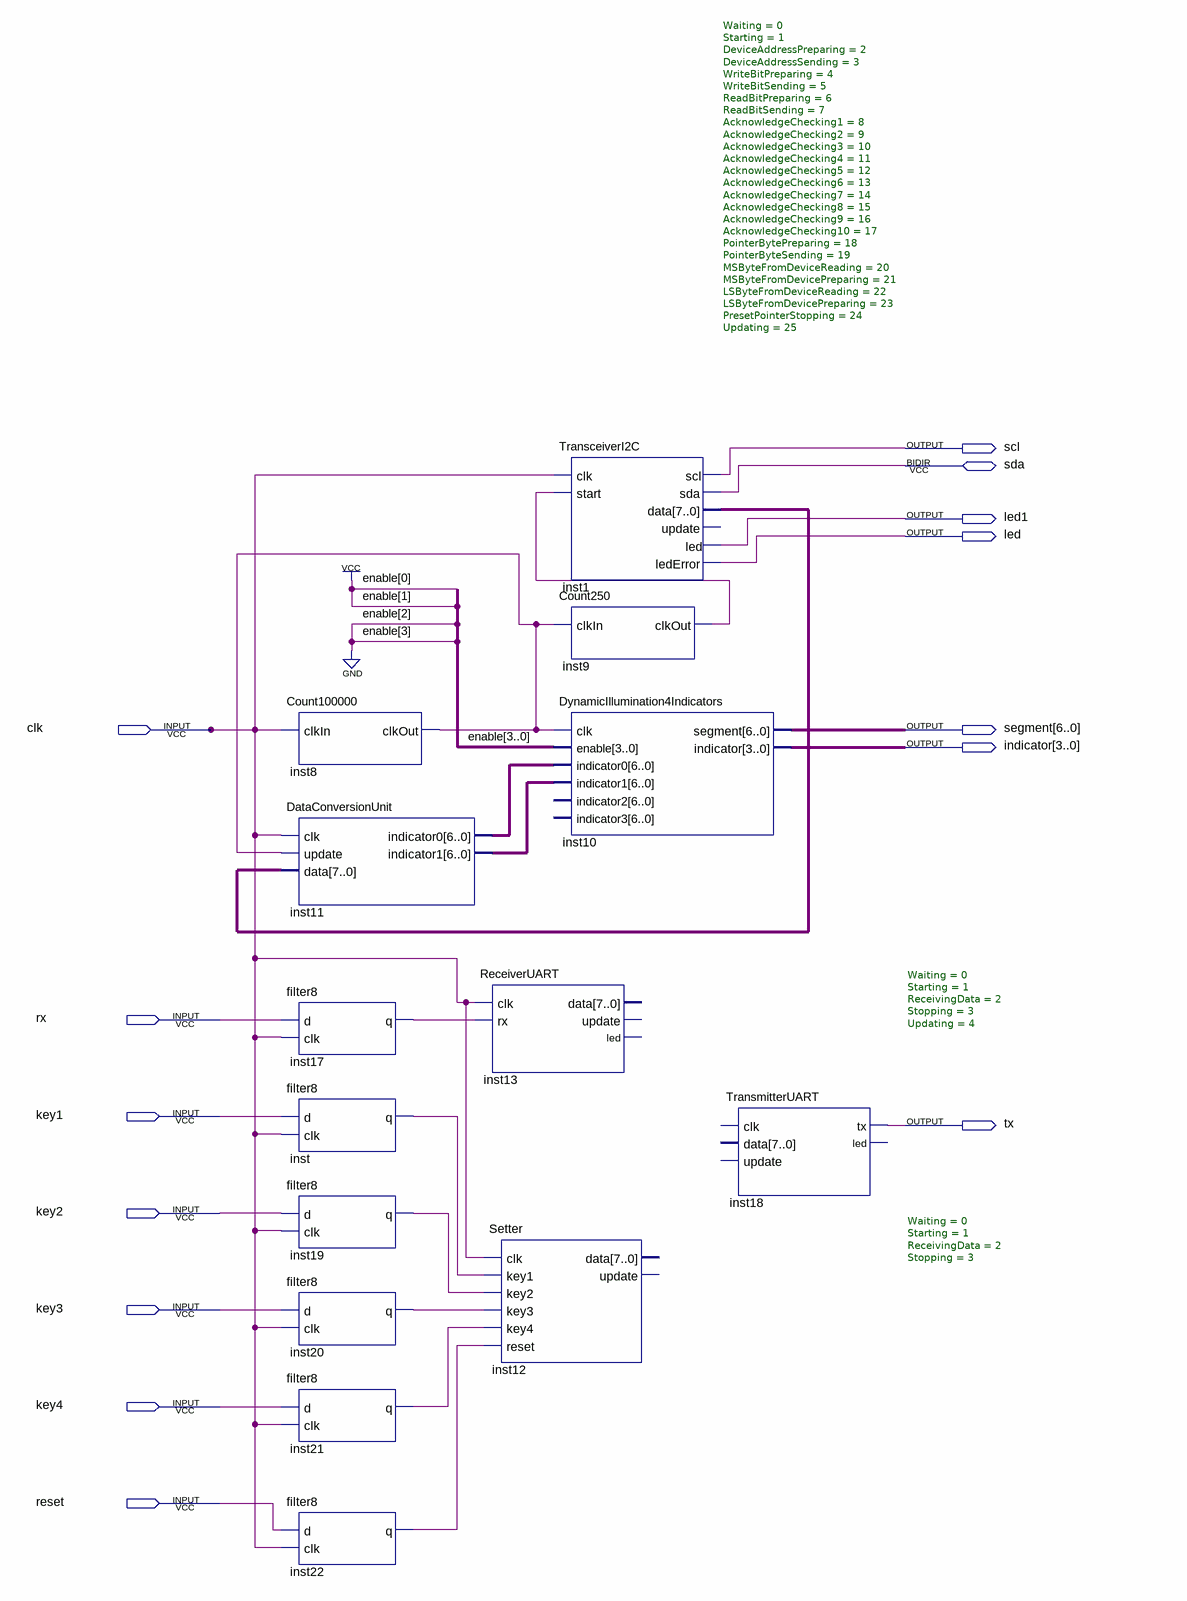
[diagram p0: schematic sheet]
// Quartus schematic VERILOGStart05.bdf as structural Verilog: 14 symbols, 14 pins
module VERILOGStart05 (
  input  clk,
  input  rx,
  input  key1,
  input  key2,
  input  key3,
  input  key4,
  input  reset,
  inout  sda,
  output scl,
  output led1,
  output led,
  output [6:0] segment,
  output [3:0] indicator,
  output tx
);

  wire inst8_clkout, inst9_clkout, inst17_q, inst19_q, inst20_q, inst21_q, inst22_q, inst_q;
  wire [6:0] inst11_indicator0, inst11_indicator1;
  wire [7:0] inst1_data;

  Count100000 inst8 (.clkIn(clk), .clkOut(inst8_clkout));
  DataConversionUnit inst11 (
    .clk(clk), .update(inst8_clkout), .data(inst1_data), .indicator0(inst11_indicator0),
    .indicator1(inst11_indicator1));
  filter8 inst17 (.d(rx), .clk(clk), .q(inst17_q));
  filter8 inst (.d(key1), .clk(clk), .q(inst_q));
  filter8 inst19 (.d(key2), .clk(clk), .q(inst19_q));
  filter8 inst20 (.d(key3), .clk(clk), .q(inst20_q));
  filter8 inst21 (.d(key4), .clk(clk), .q(inst21_q));
  filter8 inst22 (.d(reset), .clk(clk), .q(inst22_q));
  ReceiverUART #(.Waiting(0), .Starting(1), .ReceivingData(2), .Stopping(3), .Updating(4)) inst13 (
    .clk(clk), .rx(inst17_q));  // open: data, update, led
  Setter inst12 (
    .clk(clk), .key1(inst_q), .key2(inst19_q), .key3(inst20_q), .key4(inst21_q), .reset(inst22_q));  // open: data, update
  TransceiverI2C #(.Waiting(0), .Starting(1), .DeviceAddressPreparing(2), .DeviceAddressSending(3), .WriteBitPreparing(4), .WriteBitSending(5), .ReadBitPreparing(6), .ReadBitSending(7), .AcknowledgeChecking1(8), .AcknowledgeChecking2(9), .AcknowledgeChecking3(10), .AcknowledgeChecking4(11), .AcknowledgeChecking5(12), .AcknowledgeChecking6(13), .AcknowledgeChecking7(14), .AcknowledgeChecking8(15), .AcknowledgeChecking9(16), .AcknowledgeChecking10(17), .PointerBytePreparing(18), .PointerByteSending(19), .MSByteFromDeviceReading(20), .MSByteFromDevicePreparing(21), .LSByteFromDeviceReading(22), .LSByteFromDevicePreparing(23), .PresetPointerStopping(24), .Updating(25)) inst1 (
    .clk(clk), .start(inst9_clkout), .scl(scl), .data(inst1_data), .led(led1), .ledError(led), .sda(sda));  // open: update
  Count250 inst9 (.clkIn(inst8_clkout), .clkOut(inst9_clkout));
  DynamicIllumination4Indicators inst10 (
    .clk(inst8_clkout), .enable(4'b0011), .indicator0(inst11_indicator0), .indicator1(inst11_indicator1),
    .segment(segment), .indicator(indicator));  // open: indicator2, indicator3
  TransmitterUART #(.Waiting(0), .Starting(1), .ReceivingData(2), .Stopping(3)) inst18 (.tx(tx));  // open: clk, data, update, led
endmodule
